# EAGLE design me433_krout (EAGLE 8.1.0)
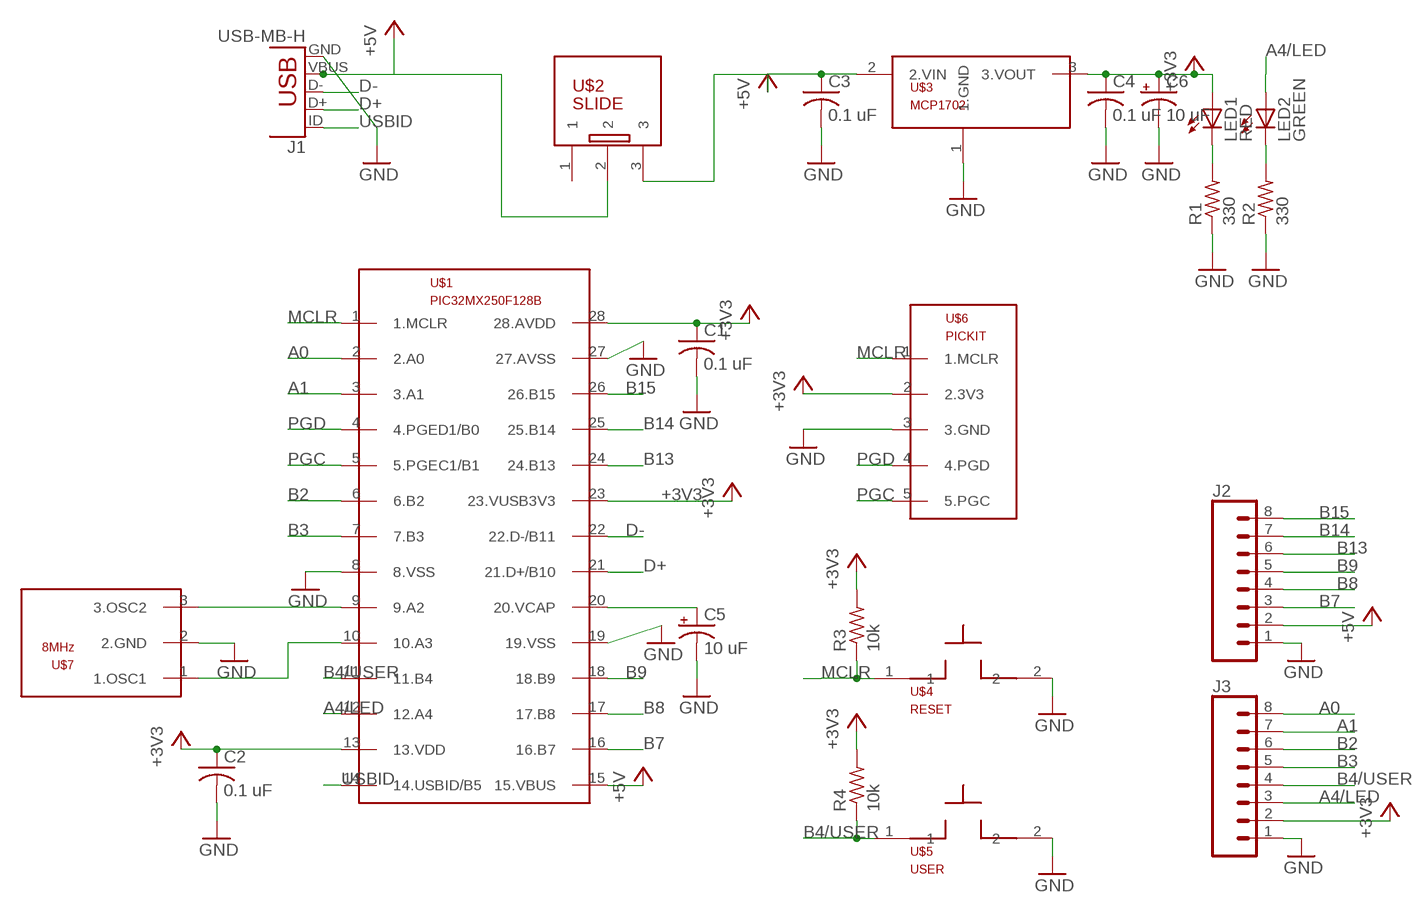
[diagram p0: schematic, sheet 1]

## Parts
C1  0.1 uF  C-US025-025X050  [C025-025X050]
C2  0.1 uF  C-US025-025X050  [C025-025X050]
C3  0.1 uF  C-US025-025X050  [C025-025X050]
C4  0.1 uF  C-US025-025X050  [C025-025X050]
C5  10 uF  CPOL-USB45181B  [B45181B]
C6  10 uF  CPOL-USB45181B  [B45181B]
J1  USB-MB-H  [USB-MB-H]
J2  CONN_08"  [1X08]
J3  CONN_08"  [1X08]
LED1  RED  LED3MM  [LED3MM]
LED2  GREEN  LED3MM  [LED3MM]
R1  330  R-US_0207/10  [0207/10]
R2  330  R-US_0207/10  [0207/10]
R3  10k  R-US_0207/10  [0207/10]
R4  10k  R-US_0207/10  [0207/10]
U$1  PIC32MX250F128B  [DIL28-3]
U$2  SLIDE  [SLIDE]
U$3  MCP1702  [TO92]
U$4  RESET  PB  [PB]
U$5  USER  PB  [PB]
U$6  PICKIT  [1X05]
U$7  8MHz  OSC  [OSC]

## Nets
+3V3: C1.1 C2.1 C4.1 C6.+ J3.2 LED1.A R3.2 R4.2 U$1.13(13.VDD) U$1.23(23.VUSB3V3) U$1.28(28.AVDD) U$3.3(3.VOUT) U$6.2(2.3V3)
+5V: C3.1 J2.2 U$1.15(15.VBUS) U$2.3 U$3.2(2.VIN)
A0: J3.8 U$1.2(2.A0)
A1: J3.7 U$1.3(3.A1)
A4/LED: J3.3 LED2.A U$1.12(12.A4)
B2: J3.6 U$1.6(6.B2)
B3: J3.5 U$1.7(7.B3)
B4/USER: J3.4 R4.1 U$1.11(11.B4) U$5.1
B7: J2.3 U$1.16(16.B7)
B8: J2.4 U$1.17(17.B8)
B9: J2.5 U$1.18(18.B9)
B13: J2.6 U$1.24(24.B13)
B14: J2.7 U$1.25(25.B14)
B15: J2.8 U$1.26(26.B15)
D+: J1.D+ U$1.21(21.D+/B10)
D-: J1.D- U$1.22(22.D-/B11)
GND: C1.2 C2.2 C3.2 C4.2 C5.- C6.- J1.GND J2.1 J3.1 R1.1 R2.1 U$1.8(8.VSS) U$1.19(19.VSS) U$1.27(27.AVSS) U$3.1(1.GND) U$4.2 U$5.2 U$6.3(3.GND) U$7.2(2.GND)
MCLR: R3.1 U$1.1(1.MCLR) U$4.1 U$6.1(1.MCLR)
N$1: LED2.K(C) R2.2
N$3: C5.+ U$1.20(20.VCAP)
N$4: LED1.K(C) R1.2
N$5: U$1.9(9.A2) U$7.3(3.OSC2)
N$6: U$1.10(10.A3) U$7.1(1.OSC1)
PGC: U$1.5(5.PGEC1/B1) U$6.5(5.PGC)
PGD: U$1.4(4.PGED1/B0) U$6.4(4.PGD)
USBID: J1.ID U$1.14(14.USBID/B5)
VBUS: J1.VBUS U$2.2 ; supply symbol labelled +5V
Unconnected: U$2.1

## Library data of the parts
C1-C4 = krout_lib:C-US: CAPACITOR, American symbol
C5 C6 = krout_lib:CPOL-US: POLARIZED CAPACITOR, American symbol
J1 = krout_lib:USB: USB Connectors USB-B-PTH is fully proven SKU : PRT-00139/CONN-08278 USB-miniB is fully proven SKU : PRT-00587 USB-A-PCB is untested. USB-A-H is throughly reviewed, but untested. Spark Fun Electronics SKU : PRT-00437 USB-B-SMT is throughly reviewed, but untested. Needs silkscreen touching up. USB-A-S has not been used/tested USB-MB-H has not been used/tested USB-MICROB has been used. CONN-09505
J2 J3 = krout_lib:CONN_08: Multi connection point. Often used as Generic Header-pin footprint for 0.1 inch spaced/style header connections On any of the 0.1 inch spaced packages, you can populate with these: Break Away Headers - Straight <https://www.sparkfun.com/products/116> (PRT-00116) Break Away Male Headers - Right Angle <https://www.sparkfun.com/products/553> (PRT-00553) Female Headers <https://www.sparkfun.com/products/115> (PRT-00115) Break Away Headers - Machine Pin <https://www.sparkfun.com/products/117> (PRT-00117) Break Away Female Headers - Swiss Machine Pin <https://www.sparkfun.com/products/743> (PRT-00743) Arduino Stackable Header - 8 Pin <https://www.sparkfun.com/products/9279> (PRT-09279) For SCREWTERMINALS and SPRING TERMINALS visit here: Screw Terimnals on SparkFun.com <https://www.sparkfun.com/search/results?term=Screw+Terminals> (5mm/3.5mm/2.54mm spacing) This device is also useful as a general connection point to wire up your design to another part of your project. Our various solder wires solder well into these plated through hole pads. Hook-Up Wire - Assortment (Stranded, 22 AWG) <https://www.sparkfun.com/products/11375> (PRT-11375) Hook-Up Wire - Assortment (Solid Core, 22 AWG) <https://www.sparkfun.com/products/11367> (PRT-11367) View the entire wire category on our website here <https://www.sparkfun.com/categories/141> Special notes: Molex polarized connector foot print use with SKU : PRT-08231 with associated crimp pins and housings. 1MM SMD Version SKU: PRT-10208 NOTES ON THE VARIANTS LOCK and LOCK_LONGPADS... This footprint was designed to help hold the alignment of a through-hole component (i.e. 6-pin header) while soldering it into place. You may notice that each hole has been shifted either up or down by 0.005 of an inch from it's more standard position (which is a perfectly straight line). This slight alteration caused the pins (the squares in the middle) to touch the edges of the holes. Because they are alternating, it causes a "brace" to hold the component in place. 0.005 has proven to be the perfect amount of "off-center" position when using our standard breakaway headers. Although looks a little odd when you look at the bare footprint, once you have a header in there, the alteration is very hard to notice. Also,if you push a header all the way into place, it is covered up entirely on the bottom side.; PROD_ID: CONN-08438
LED1 LED2 = led:LED: LED OSRAM: - CHIPLED LG R971, LG N971, LY N971, LG Q971, LY Q971, LO R971, LY R971 LH N974, LH R974 LS Q976, LO Q976, LY Q976 LO Q996 - Hyper CHIPLED LW Q18S LB Q993, LB Q99A, LB R99A - SideLED LS A670, LO A670, LY A670, LG A670, LP A670 LB A673, LV A673, LT A673, LW A673 LH A674 LY A675 LS A676, LA A676, LO A676, LY A676, LW A676 LS A679, LY A679, LG A679 - Hyper Micro SIDELED® LS Y876, LA Y876, LO Y876, LY Y876 LT Y87S - SmartLED LW L88C, LW L88S LB L89C, LB L89S, LG L890 LS L89K, LO L89K, LY L89K LS L896, LA L896, LO L896, LY L896 - TOPLED LS T670, LO T670, LY T670, LG T670, LP T670 LSG T670, LSP T670, LSY T670, LOP T670, LYG T670 LG T671, LOG T671, LSG T671 LB T673, LV T673, LT T673, LW T673 LH T674 LS T676, LA T676, LO T676, LY T676, LB T676, LH T676, LSB T676, LW T676 LB T67C, LV T67C, LT T67C, LS T67K, LO T67K, LY T67K, LW E67C LS E67B, LA E67B, LO E67B, LY E67B, LB E67C, LV E67C, LT E67C LW T67C LS T679, LY T679, LG T679 LS T770, LO T770, LY T770, LG T770, LP T770 LB T773, LV T773, LT T773, LW T773 LH T774 LS E675, LA E675, LY E675, LS T675 LS T776, LA T776, LO T776, LY T776, LB T776 LHGB T686 LT T68C, LB T68C - Hyper Mini TOPLED® LB M676 - Mini TOPLED Santana® LG M470 LS M47K, LO M47K, LY M47K Source: http://www.osram.convergy.de LUXEON: - LUMILED® LXK2-PW12-R00, LXK2-PW12-S00, LXK2-PW14-U00, LXK2-PW14-V00 LXK2-PM12-R00, LXK2-PM12-S00, LXK2-PM14-U00 LXK2-PE12-Q00, LXK2-PE12-R00, LXK2-PE12-S00, LXK2-PE14-T00, LXK2-PE14-U00 LXK2-PB12-K00, LXK2-PB12-L00, LXK2-PB12-M00, LXK2-PB14-N00, LXK2-PB14-P00, LXK2-PB14-Q00 LXK2-PR12-L00, LXK2-PR12-M00, LXK2-PR14-Q00, LXK2-PR14-R00 LXK2-PD12-Q00, LXK2-PD12-R00, LXK2-PD12-S00 LXK2-PH12-R00, LXK2-PH12-S00 LXK2-PL12-P00, LXK2-PL12-Q00, LXK2-PL12-R00 Source: www.luxeon.com KINGBRIGHT: KA-3528ASYC Source: www.kingbright.com
R1-R4 = krout_lib:R-US_: RESISTOR, American symbol
U$1 = krout_lib:PIC32MX250F128B
U$2 = krout_lib:SLIDE
U$3 = krout_lib:MCP1702
U$4 U$5 = krout_lib:PB
U$6 = krout_lib:PICKIT
U$7 = krout_lib:OSC

## Board
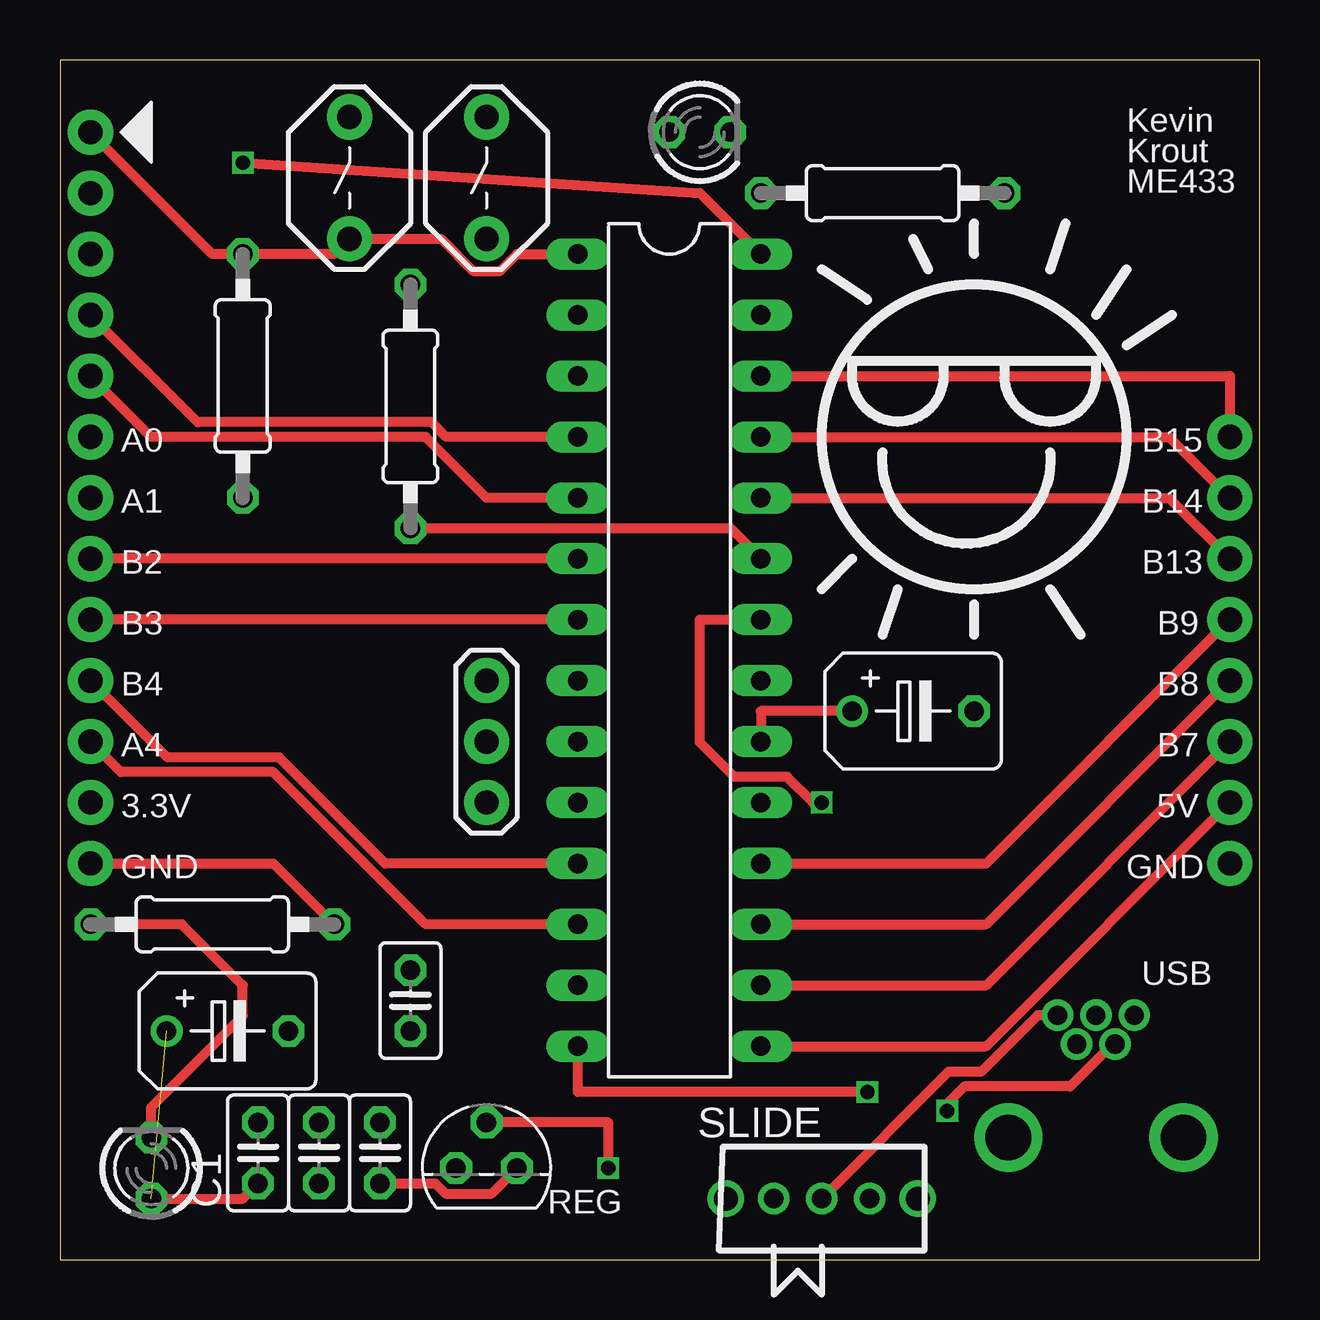
[diagram p1: board, top side]
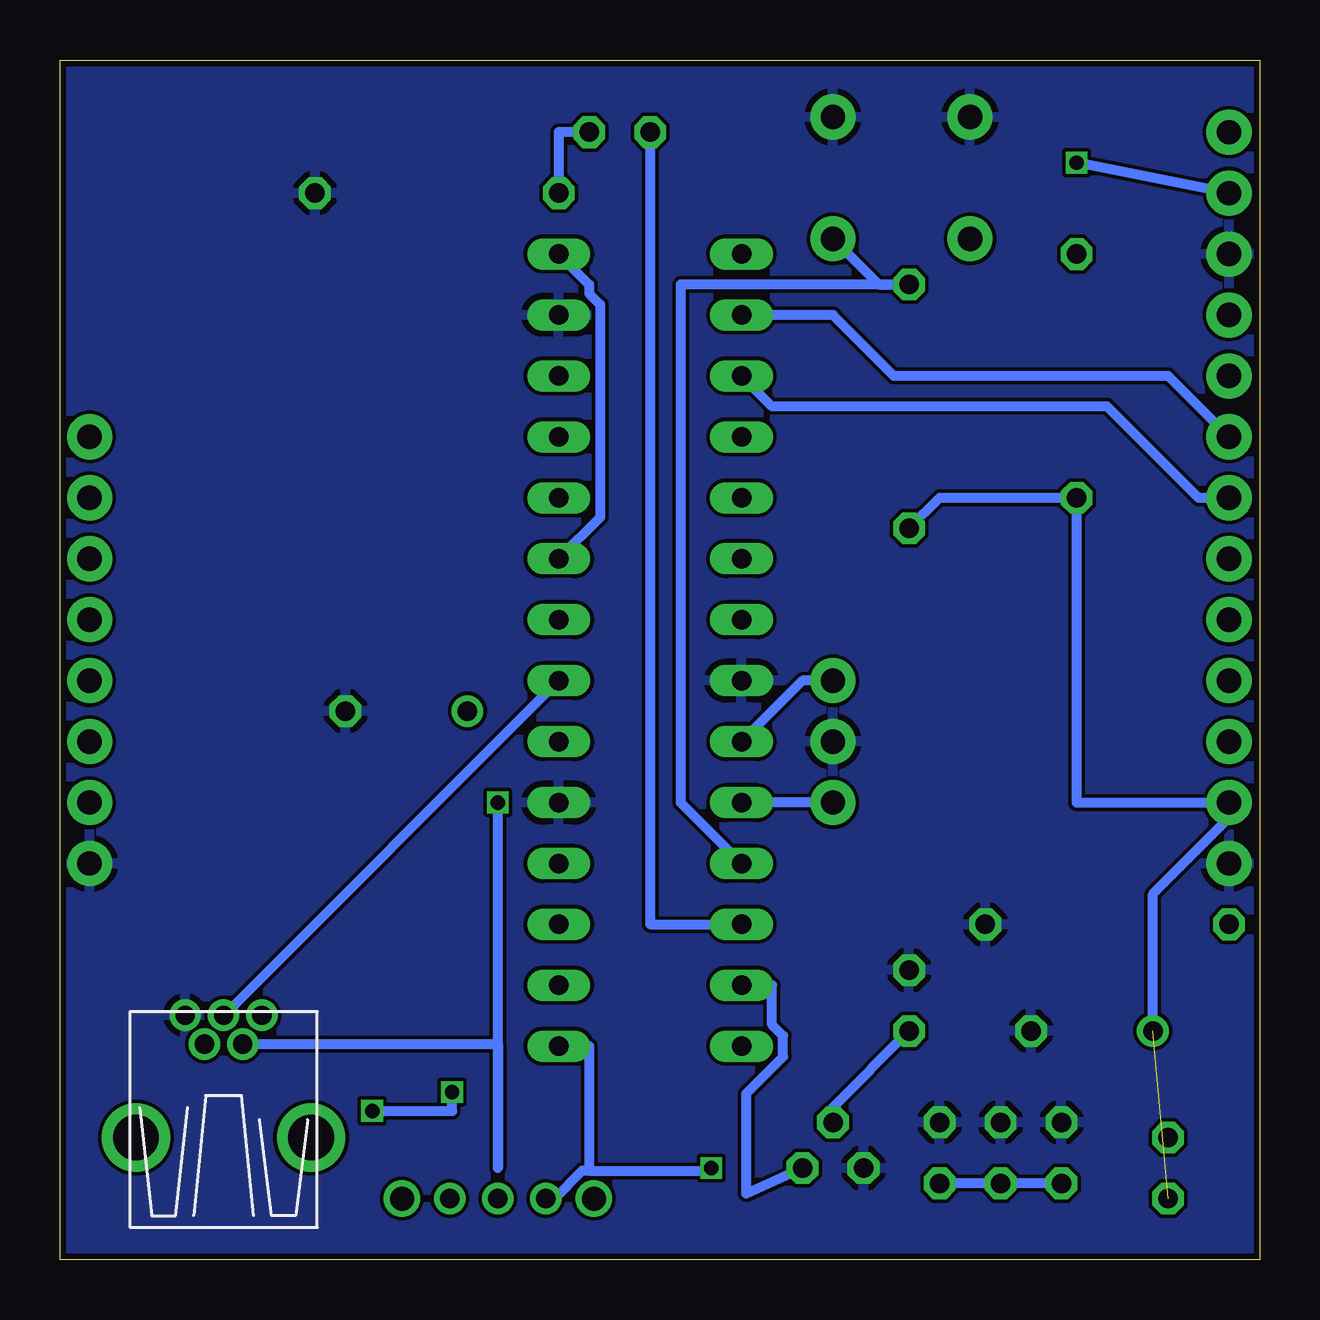
[diagram p2: board, bottom side, seen from below]

Size 50 x 50 mm. Coordinates in mm from the lower left corner, seen from the top.
Outline: 0,0 50,0 50,50 0,50 0,0
Copper layers (1*16): Top 0.035mm / dielectric 1.5mm / Bottom 0.035mm
Design rules "SeeedStudio_2layer_DRU_no_angle_20140221": minimum track width 6mil, minimum drill 12mil, track to track 6mil, track to pad 6mil, pad to pad 6mil, via to via 6mil, smd to smd 0mil, copper to edge 10mil, drill to drill 10mil, minimum pad ring 10mil, minimum via ring 6mil, stop-mask expansion 2mil, vias tented up to drill 100mil, thermal gap 10mil

### Footprints (pad centres in the part's own frame; a part is rotated, then mirrored left to right if it is on the bottom)
C025-025X050 = drill 0.813 octagon: 1 -1.27,0; 2 1.27,0
B45181B = drill 0.813: + -2.54,0 | drill 0.813 octagon: - 2.54,0
USB-MB-H = drill 0.8: D+ 5.1,0; D- 3.9,0.8; GND 5.1,-1.6; ID 3.9,-0.8; VBUS 5.1,1.6 | drill 1.9: P$6 0,-3.65; P$7 0,3.65
1X08 = drill 1.016 pad 1.88: 1 0,0; 2 2.54,0; 3 5.08,0; 4 7.62,0; 5 10.16,0; 6 12.7,0; 7 15.24,0; 8 17.78,0
LED3MM = drill 0.813 octagon: A -1.27,0; K 1.27,0
0207/10 = drill 0.813 octagon: 1 -5.08,0; 2 5.08,0
DIL28-3 = drill 0.813 long: 1 -16.51,-3.81; 2 -13.97,-3.81; 3 -11.43,-3.81; 4 -8.89,-3.81; 5 -6.35,-3.81; 6 -3.81,-3.81; 7 -1.27,-3.81; 8 1.27,-3.81; 9 3.81,-3.81; 10 6.35,-3.81; 11 8.89,-3.81; 12 11.43,-3.81; 13 13.97,-3.81; 14 16.51,-3.81; 15 16.51,3.81; 16 13.97,3.81; 17 11.43,3.81; 18 8.89,3.81; 19 6.35,3.81; 20 3.81,3.81; 21 1.27,3.81; 22 -1.27,3.81; 23 -3.81,3.81; 24 -6.35,3.81; 25 -8.89,3.81; 26 -11.43,3.81; 27 -13.97,3.81; 28 -16.51,3.81
SLIDE = drill 0.8: 1 -2,0; 2 0,0; 3 2,0 | drill 1: P$1 -4,0; P$2 4,0
TO92 = drill 0.813 octagon: 1 -1.27,0; 2 0,1.905; 3 1.27,0
PB = drill 1.016 pad 1.88: 1 -2.54,0; 2 2.54,0
1X05 = drill 1.016 pad 1.88: 1 0,0; 2 2.54,0; 3 5.08,0; 4 7.62,0; 5 10.16,0
OSC = drill 1.016 pad 1.88: 1 -2.54,0; 2 0,0; 3 2.54,0

### Placement (x,y rotation side)
C1  8.26,4.45 90 top
C2  10.79,4.45 90 top
C3  14.61,10.79 90 top
C4  13.34,4.45 90 top
C5  35.56,22.86 0 top
C6  6.99,9.53 0 top
J1  43.18,5.08 90 top
J2  48.77,16.51 90 top
J3  1.27,16.51 90 top
LED1  3.81,3.81 90 top
LED2  26.67,46.99 0 top
R1  6.35,13.97 180 top
R2  34.29,44.45 180 top
R3  7.62,36.83 270 top
R4  14.61,35.56 270 top
U$1  25.4,25.4 270 top
U$2  31.75,2.54 180 top
U$3  17.78,3.81 0 top
U$4  12.06,45.09 90 top
U$5  17.78,45.09 90 top
U$6  1.27,46.99 270 top
U$7  17.78,21.59 90 top

### Tracks (layer width: path | path; a pad name or v marks a point on that pad's centre or on a via)
+3V3  (via drill 0.6)  (1 unrouted)
  Top 0.406: R4.2 27.94,30.48 U$1.23 | v7.62,45.72 26.67,44.45 U$1.28 | LED1.A 7.62,2.54 C1.1 | C4.1 15.64,3.17 16.07,2.74 17.98,2.74 U$3.3
  Bottom 0.406: C1.1 C2.1 C4.1 | U$3.3 21.39,2.74 21.39,6.92 19.86,8.45 19.86,9.33 20.32,9.79 20.32,11.43 U$1.13 | R4.2 13.34,31.75 R3.2 7.62,19.05 J3.2 1.27,18.41 1.59,18.1 2.62,17.07 4.45,15.24 C6.+ | U$1.28 27.94,40.64 27.94,40.27 27.48,39.81 27.48,30.94 U$1.23 | U$6.2 v7.62,45.72
+5V  (via drill 0.6)
  Top 0.406: U$1.15 38.61,8.89 J2.2 | v22.86,3.81 22.86,5.71 U$3.2
  Bottom 0.406: U$2.3 29.39,2.54 28.23,3.7 27.94,3.7 | v22.86,3.81 22.97,3.7 27.94,3.7 | U$1.15 27.94,8.89 27.94,3.7 | U$3.2 17.78,6.35 C3.1
A0
  Bottom 0.406: J3.8 3.81,36.83 15.24,36.83 17.78,39.37 U$1.2
A1
  Bottom 0.406: J3.7 2.54,31.75 6.35,35.56 20.32,35.56 U$1.3
A4/LED
  Top 0.406: U$1.12 15.24,13.97 8.89,20.32 2.54,20.32 J3.3
  Bottom 0.406: LED2.A 25.4,13.97 U$1.12
B2
  Top 0.406: U$1.6 J3.6
B3
  Top 0.406: U$1.7 J3.5
B4/USER
  Top 0.406: J3.4 4.47,20.93 9.14,20.93 13.56,16.51 U$1.11
  Bottom 0.406: U$5.1 15.88,40.64 R4.1 24.13,40.64 24.13,19.05 U$1.11
B7
  Top 0.406: U$1.16 38.61,11.43 J2.3
B8
  Top 0.406: U$1.17 38.61,13.97 J2.4
B9
  Top 0.406: U$1.18 38.61,16.51 J2.5
B13
  Top 0.406: U$1.24 46.23,31.75 J2.6
B14
  Top 0.406: U$1.25 46.23,34.29 J2.7
B15
  Top 0.406: U$1.26 48.77,36.83 J2.8
D+
  Bottom 0.406: J1.D+ 43.16,10.18 U$1.21
D-  (via drill 0.6)
  Top 0.406: v31.75,19.05 31.38,19.05 30.31,20.12 28.11,20.12 26.67,21.55 26.67,26.67 U$1.22
  Bottom 0.406: v31.75,19.05 31.75,3.81 31.75,8.98 J1.D-
GND
  Top 0.406: J3.1 8.89,16.51 R1.1
  pour Bottom (isolate 0.03): 0,50.8 0,-1.27 50.8,-1.27 50.8,50.8
MCLR
  Top 0.406: U$6.1 6.35,41.91 R3.1 11.43,41.91 U$4.1 15.88,42.55 17.22,41.2 18.34,41.2 19.05,41.91 U$1.1
N$1
  Bottom 0.406: LED2.K 29.21,46.99 R2.2
N$3
  Top 0.406: C5.+ 29.21,22.86 U$1.20
N$4
  Top 0.406: LED1.K 3.81,6.35 7.62,10.16 7.62,11.43 5.08,13.97 R1.2
N$5
  Bottom 0.406: U$7.3 19.05,24.13 U$1.9
N$6
  Bottom 0.406: U$7.1 U$1.10
PGC
  Top 0.406: U$1.5 17.78,31.75 15.24,34.29 3.81,34.29 U$6.5
PGD
  Top 0.406: U$1.4 16.1,34.29 15.49,34.9 5.74,34.9 U$6.4
USBID  (via drill 0.6)
  Top 0.406: J1.ID 43.88,8.98 42.11,7.21 37.69,7.21 36.83,6.35 36.99,6.35 v36.99,6.19 | v33.66,6.99 21.59,6.99 U$1.14
  Bottom 0.406: v36.99,6.19 33.66,6.19 v33.66,6.99
VBUS
  Top 0.406: J1.VBUS 40.76,10.18 38.4,7.82 37.03,7.82 U$2.2

### Text on the board
tPlace: Kevin | Krout | ME433 | A0 | B15 | A1 | B14 | B2 | B13 | B3 | B9 | B4 | B8 | A4 | B7 | 3.3V | 5V | GND | GND | USB | REG